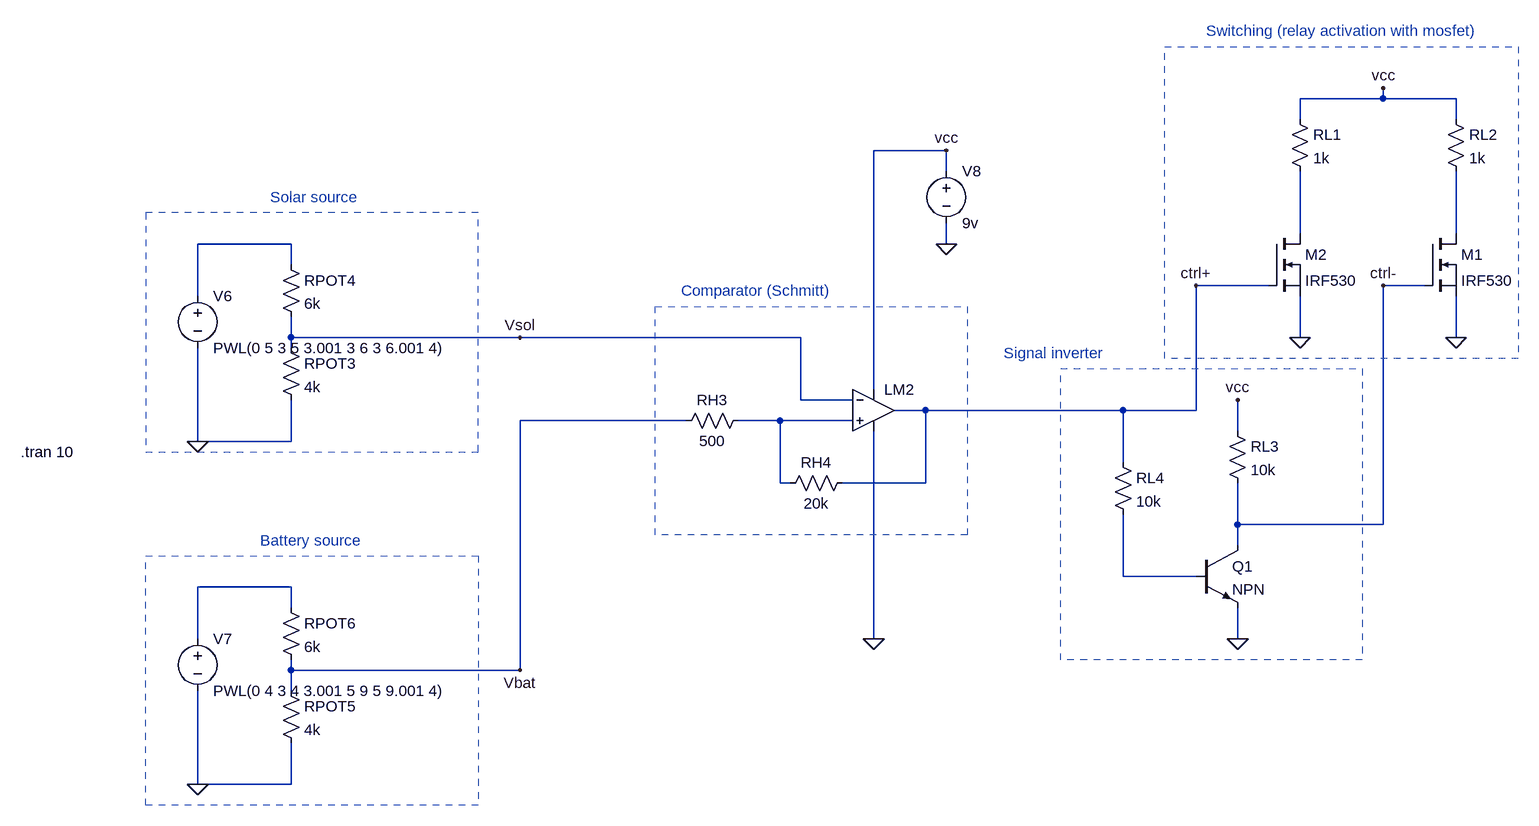
[diagram p0: schematic 4.power_select.asc]
4.power_select.asc, the LTspice schematic file:
Version 4.1
SHEET 1 3368 1428
WIRE 2576 336 2576 320
WIRE 2576 336 2448 336
WIRE 2688 336 2576 336
WIRE 2448 368 2448 336
WIRE 2688 368 2688 336
WIRE 1904 416 1792 416
WIRE 1904 448 1904 416
WIRE 2448 544 2448 448
WIRE 2688 544 2688 448
WIRE 896 560 752 560
WIRE 1904 560 1904 528
WIRE 896 592 896 560
WIRE 2400 624 2288 624
WIRE 2640 624 2576 624
WIRE 752 640 752 560
WIRE 896 704 896 672
WIRE 1248 704 896 704
WIRE 1680 704 1248 704
WIRE 2448 704 2448 640
WIRE 2688 704 2688 640
WIRE 896 720 896 704
WIRE 1792 784 1792 416
WIRE 1680 800 1680 704
WIRE 1760 800 1680 800
WIRE 1872 816 1824 816
WIRE 2176 816 1872 816
WIRE 2288 816 2288 624
WIRE 2288 816 2176 816
WIRE 1504 832 1248 832
WIRE 1648 832 1584 832
WIRE 1760 832 1648 832
WIRE 2352 848 2352 800
WIRE 752 864 752 720
WIRE 896 864 896 800
WIRE 896 864 752 864
WIRE 2176 896 2176 816
WIRE 1648 928 1648 832
WIRE 1664 928 1648 928
WIRE 1872 928 1872 816
WIRE 1872 928 1744 928
WIRE 2352 992 2352 928
WIRE 2576 992 2576 624
WIRE 2576 992 2352 992
WIRE 2352 1024 2352 992
WIRE 2176 1072 2176 976
WIRE 2288 1072 2176 1072
WIRE 896 1088 752 1088
WIRE 896 1120 896 1088
WIRE 752 1168 752 1088
WIRE 1792 1168 1792 848
WIRE 2352 1168 2352 1120
WIRE 896 1216 896 1200
WIRE 1248 1216 1248 832
WIRE 1248 1216 896 1216
WIRE 896 1248 896 1216
WIRE 752 1392 752 1248
WIRE 896 1392 896 1328
WIRE 896 1392 752 1392
FLAG 1248 1216 Vbat
FLAG 1248 704 Vsol
FLAG 1792 1168 0
FLAG 1904 560 0
FLAG 752 1392 0
FLAG 752 864 0
FLAG 1904 416 vcc
FLAG 2352 800 vcc
FLAG 2352 1168 0
FLAG 2576 320 vcc
FLAG 2448 704 0
FLAG 2688 704 0
FLAG 2288 624 ctrl+
FLAG 2576 624 ctrl-
SYMBOL voltage 752 624 R0
WINDOW 123 0 0 Left 0
WINDOW 39 0 0 Left 0
SYMATTR InstName V6
SYMATTR Value PWL(0 5 3 5 3.001 3 6 3 6.001 4)
SYMBOL res 880 704 R0
SYMATTR InstName RPOT3
SYMATTR Value 4k
SYMBOL res 880 576 R0
SYMATTR InstName RPOT4
SYMATTR Value 6k
SYMBOL voltage 752 1152 R0
WINDOW 123 0 0 Left 0
WINDOW 39 0 0 Left 0
SYMATTR InstName V7
SYMATTR Value PWL(0 4 3 4 3.001 5 9 5 9.001 4)
SYMBOL res 880 1232 R0
SYMATTR InstName RPOT5
SYMATTR Value 4k
SYMBOL res 880 1104 R0
SYMATTR InstName RPOT6
SYMATTR Value 6k
SYMBOL OpAmps\\UniversalOpAmp2 1792 816 R0
SYMATTR InstName LM2
SYMATTR Value2 Avol=140k GBW=1.2Meg Slew=0.5Meg
SYMATTR SpiceLine Ilimit=40m Rail=0 Vos=2.5m
SYMATTR SpiceLine2 En=0 Enk=0 In=0 Ink=0 Rin=10Meg
SYMBOL res 1600 816 R90
WINDOW 0 0 56 VBottom 2
WINDOW 3 32 56 VTop 2
SYMATTR InstName RH3
SYMATTR Value 500
SYMBOL res 1760 912 R90
WINDOW 0 0 56 VBottom 2
WINDOW 3 32 56 VTop 2
SYMATTR InstName RH4
SYMATTR Value 20k
SYMBOL voltage 1904 432 R0
WINDOW 123 0 0 Left 0
WINDOW 39 0 0 Left 0
SYMATTR InstName V8
SYMATTR Value 9v
SYMBOL nmos 2400 544 R0
SYMATTR InstName M2
SYMATTR Value IRF530
SYMBOL res 2432 352 R0
SYMATTR InstName RL1
SYMATTR Value 1k
SYMBOL npn 2288 1024 R0
SYMATTR InstName Q1
SYMBOL res 2336 832 R0
SYMATTR InstName RL3
SYMATTR Value 10k
SYMBOL res 2160 880 R0
SYMATTR InstName RL4
SYMATTR Value 10k
SYMBOL res 2672 352 R0
SYMATTR InstName RL2
SYMATTR Value 1k
SYMBOL nmos 2640 544 R0
SYMATTR InstName M1
SYMATTR Value IRF530
TEXT 480 880 Left 2 !.tran 10
TEXT 864 488 Left 2 ;Solar source
TEXT 848 1016 Left 2 ;Battery source
TEXT 1496 632 Left 2 ;Comparator (Schmitt)
TEXT 2304 232 Left 2 ;Switching (relay activation with mosfet)
TEXT 1992 728 Left 2 ;Signal inverter
RECTANGLE Normal 1184 512 672 880 2
RECTANGLE Normal 1184 1424 672 1040 2
RECTANGLE Normal 1936 1008 1456 656 2
RECTANGLE Normal 2784 736 2240 256 2
RECTANGLE Normal 2544 1200 2080 752 2

The netlist it stands for:
* 4.power_select.asc
V6 N003 0 PWL(0 5 3 5 3.001 3 6 3 6.001 4)
RPOT3 Vsol 0 4k
RPOT4 N003 Vsol 6k
V7 N006 0 PWL(0 4 3 4 3.001 5 9 5 9.001 4)
RPOT5 Vbat 0 4k
RPOT6 N006 Vbat 6k
X§LM2 N004 Vsol vcc 0 ctrl+ level2 Avol=140k GBW=1.2Meg Slew=0.5Meg Ilimit=40m Rail=0 Vos=2.5m En=0 Enk=0 In=0 Ink=0 Rin=10Meg  ; pins In+ In- V+ V- OUT
RH3 N004 Vbat 500
RH4 ctrl+ N004 20k
V8 vcc 0 9v
M2 N001 ctrl+ 0 0 IRF530
RL1 vcc N001 1k
Q1 ctrl- N005 0 0 NPN
RL3 vcc ctrl- 10k
RL4 ctrl+ N005 10k
RL2 vcc N002 1k
M1 N002 ctrl- 0 0 IRF530
.model NPN NPN
.model PNP PNP
.lib standard.bjt
.model NMOS NMOS
.model PMOS PMOS
.lib standard.mos
.tran 10
* Solar source
* Battery source
* Comparator (Schmitt)
* Switching (relay activation with mosfet)
* Signal inverter
.lib UniversalOpAmp2.lib
.backanno
.end